# EAGLE design LipSync_Joystick_Board (EAGLE 9.5.2)
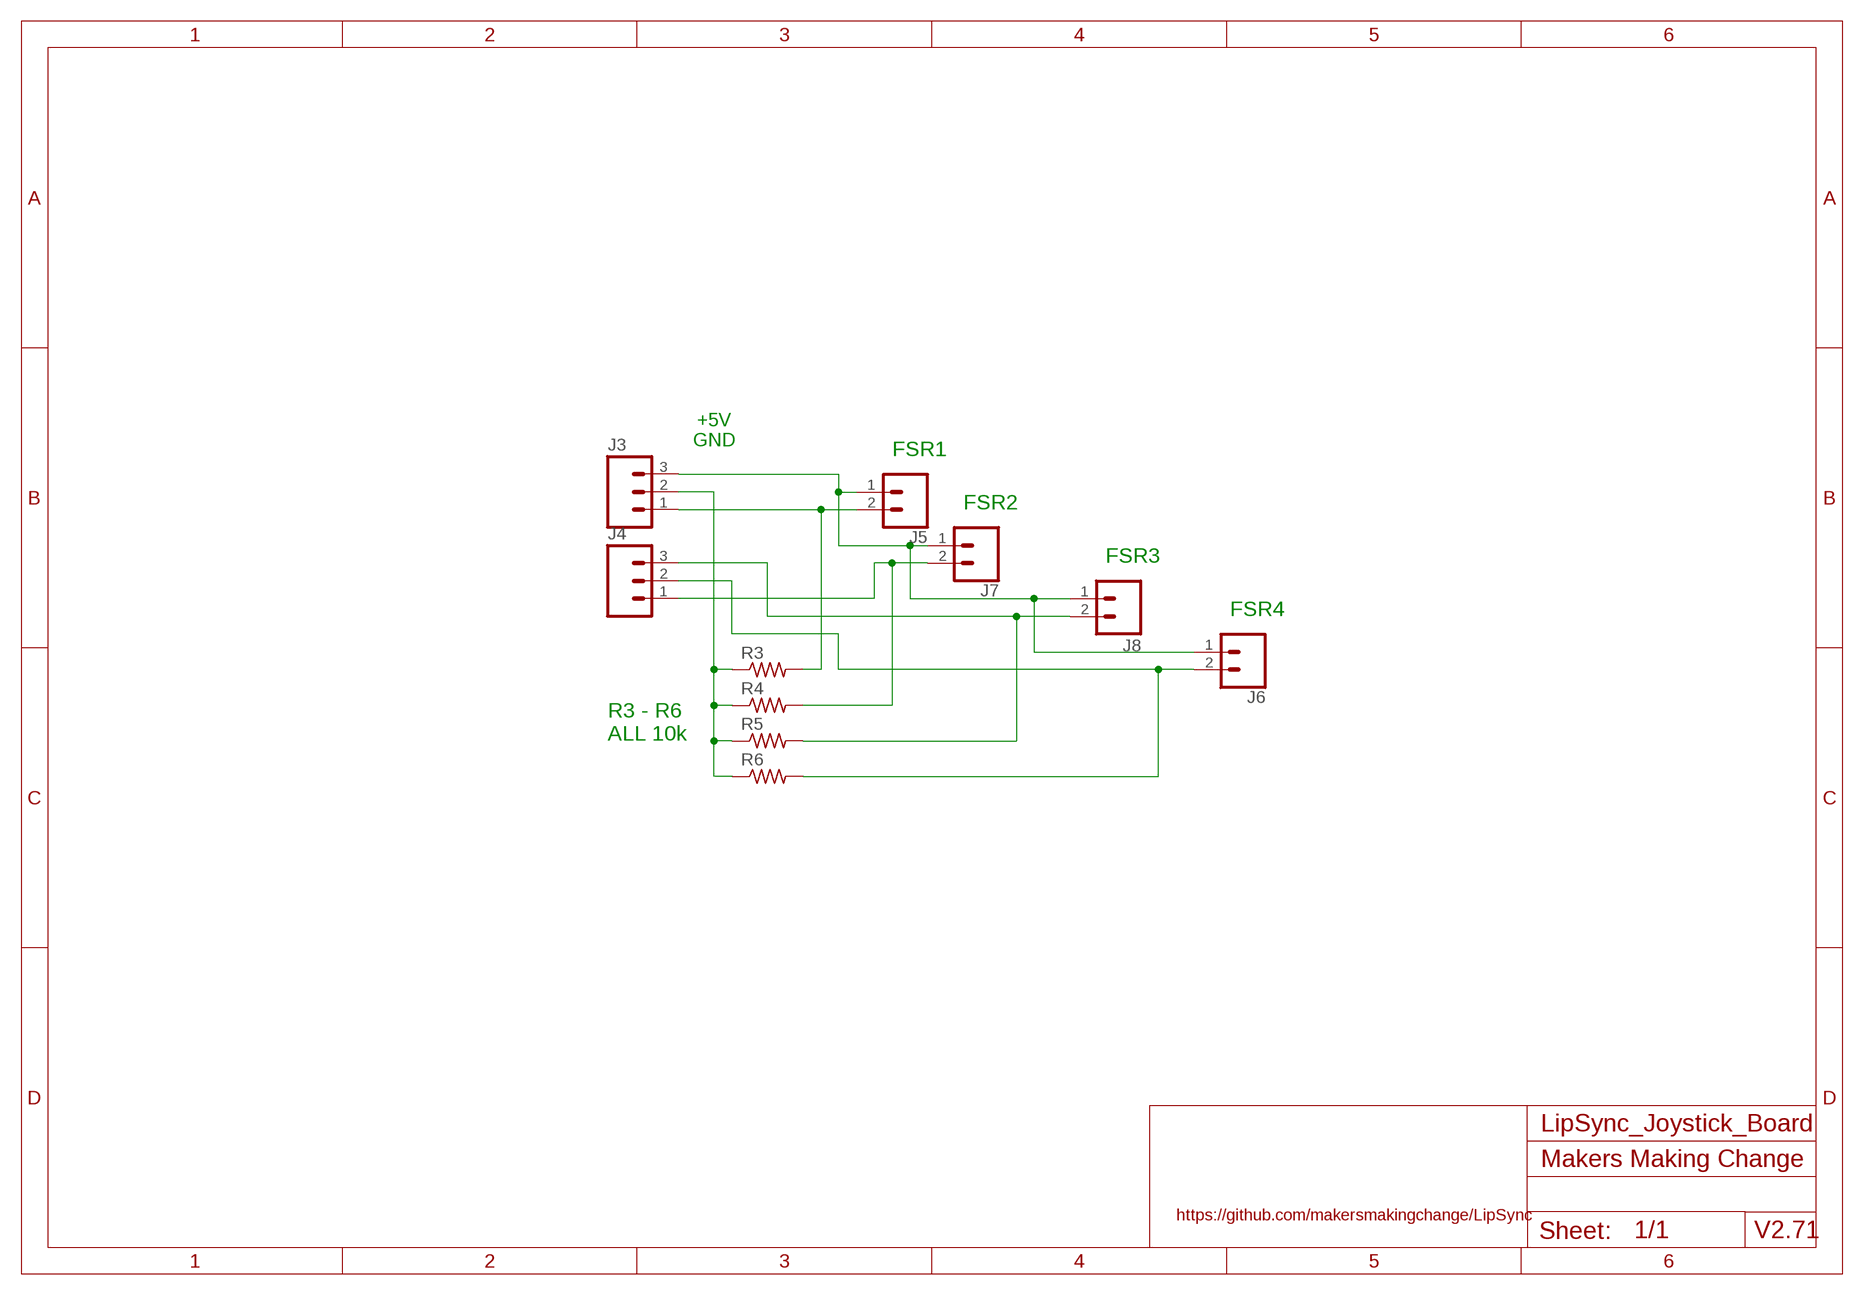
[diagram p0: schematic, sheet 1]

## Parts
J3  M03LOCK  [1X03_LOCK]
J4  M03LOCK  [1X03_LOCK]
J5  CONN_02PTH3  [1X02_LONGPADS]
J6  CONN_02PTH3  [1X02_LONGPADS]
J7  CONN_02PTH3  [1X02_LONGPADS]
J8  M02PTH3  [1X02_LONGPADS@1]
R3  R-US_0204/5  [0204/5]
R4  R-US_0204/5  [0204/5]
R5  R-US_0204/5  [0204/5]
R6  R-US_0204/5  [0204/5]

## Nets
GND3: J3.2 R3.1 R4.1 R5.1 R6.1
N$16: J3.3 J5.1 J6.1 J7.1 J8.1
N$22: J3.1 J5.2 R3.2
N$24: J4.1 J7.2 R4.2
N$27: J4.3 J8.2 R5.2
N$28 [GND3]: J4.2 J6.2 R6.2

## Notes on the sheet
- +5V
  GND
- FSR1
- FSR2
- FSR3
- FSR4
- R3 - R6
  ALL 10k
- Makers Making Change
- https://github.com/makersmakingchange/LipSync
- V2.71

## Library data of the parts
J3 J4 = SparkFun-Connectors:M03: Header 3 Standard 3-pin 0.1" header. Use with straight break away headers (SKU : PRT-00116), right angle break away headers (PRT-00553), swiss pins (PRT-00743), machine pins (PRT-00117), and female headers (PRT-00115). Molex polarized connector foot print use with SKU : PRT-08232 with associated crimp pins and housings.
J5-J7 = SparkFun-Connectors:CONN_02: Multi connection point. Often used as Generic Header-pin footprint for 0.1 inch spaced/style header connections On any of the 0.1 inch spaced packages, you can populate with these: Break Away Headers - Straight <https://www.sparkfun.com/products/116> (PRT-00116) Break Away Male Headers - Right Angle <https://www.sparkfun.com/products/553> (PRT-00553) Female Headers <https://www.sparkfun.com/products/115> (PRT-00115) Break Away Headers - Machine Pin <https://www.sparkfun.com/products/117> (PRT-00117) Break Away Female Headers - Swiss Machine Pin <https://www.sparkfun.com/products/743> (PRT-00743) For SCREWTERMINALS and SPRING TERMINALS visit here: Screw Terimnals on SparkFun.com <https://www.sparkfun.com/search/results?term=Screw+Terminals> (5mm/3.5mm/2.54mm spacing) This device is also useful as a general connection point to wire up your design to another part of your project. Our various solder wires solder well into these plated through hole pads. Hook-Up Wire - Assortment (Stranded, 22 AWG) <https://www.sparkfun.com/products/11375> (PRT-11375) Hook-Up Wire - Assortment (Solid Core, 22 AWG) <https://www.sparkfun.com/products/11367> (PRT-11367) View the entire wire category on our website here <https://www.sparkfun.com/categories/141> Special notes: Molex polarized connector foot print use with: PRT-08233 with associated crimp pins and housings. 2.54_SCREWTERM for use with PRT-10571. 3.5mm Screw Terminal footprints for PRT-08084 5mm Screw Terminal footprints for use with PRT-08432
J8 = SparkFun-Connectors:M02: Standard 2-pin 0.1" header. Use with - straight break away headers ( PRT-00116) - right angle break away headers (PRT-00553) - swiss pins (PRT-00743) - machine pins (PRT-00117) - female headers (PRT-00115) Molex polarized connector foot print use with: PRT-08233 with associated crimp pins and housings. 2.54_SCREWTERM for use with PRT-10571. 3.5mm Screw Terminal footprints for PRT-08084 5mm Screw Terminal footprints for use with PRT-08432
R3-R6 = resistor:R-US_: RESISTOR, American symbol

## Net classes
0 GND: clearance 0.205 mm
2 GND2: clearance 0.205 mm to class 0, clearance 0.205 mm to class 1, clearance 0.205 mm
3 GND3: clearance 0.205 mm to class 0, clearance 0.205 mm to class 1, clearance 0.205 mm to class 2, clearance 0.205 mm

## Board
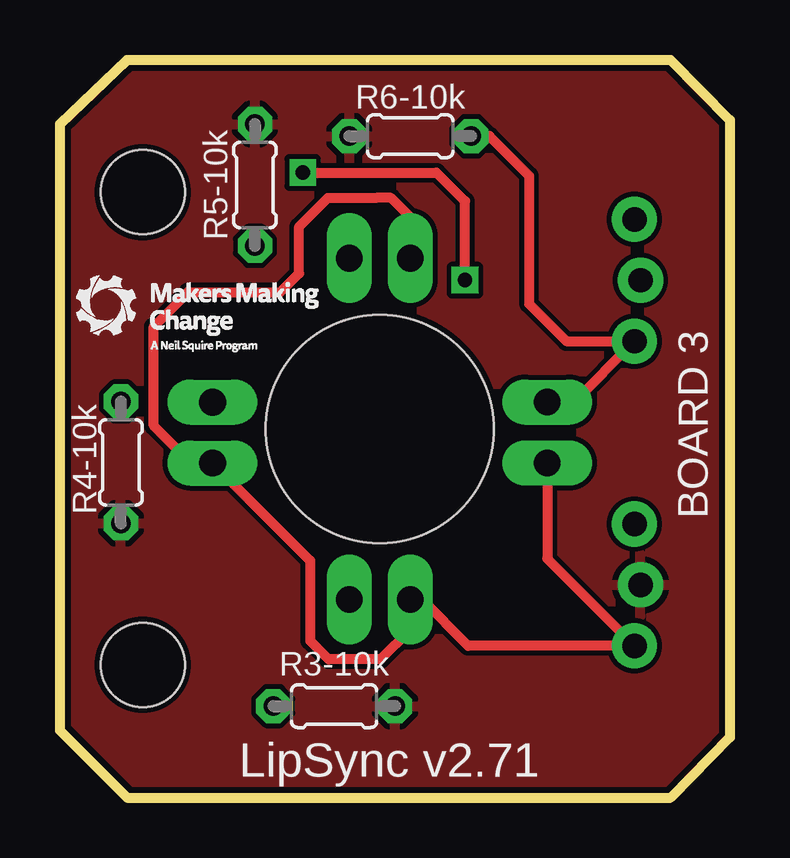
[diagram p1: board, top side]
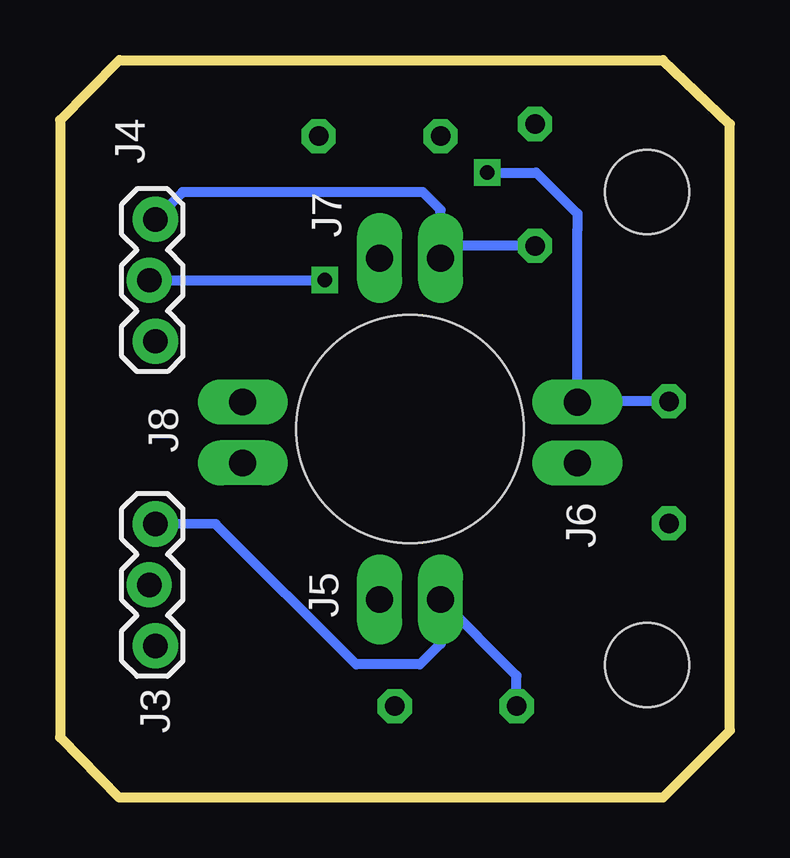
[diagram p2: board, bottom side, seen from below]

Size 27.93 x 30.73 mm. Coordinates in mm from the lower left corner, seen from the top.
Outline: 27.93,28.23 25.46,30.73 2.79,30.73 0,28.07 0,2.79 2.79,0 25.46,0 27.93,2.51 27.93,28.23
Copper layers (1*16): Top 0.035mm / dielectric 1.5mm / Bottom 0.035mm
Design rules "SparkFun": minimum track width 8mil, minimum drill 20mil, track to track 8mil, track to pad 8mil, pad to pad 8mil, via to via 8mil, smd to smd 8mil, copper to edge 10mil, drill to drill 8mil, minimum pad ring 12mil, minimum via ring 10mil, stop-mask expansion 4mil, vias tented up to drill 25mil, thermal gap 10mil
Holes 9.5 mm at 13.34,15.37
Holes 3.5 mm at 3.45,5.53 3.45,25.23

### Footprints (pad centres in the part's own frame; a part is rotated, then mirrored left to right if it is on the bottom)
1X03_LOCK = drill 1.016 pad 1.88: 1 0,0.127; 2 2.54,-0.127; 3 5.08,0.127
1X02_LONGPADS = drill 1.118 pad 1.88 long: 1 0,0; 2 2.54,0
1X02_LONGPADS@1 = drill 1.118 pad 1.88 long: 1 0,0; 2 2.54,0
0204/5 = drill 0.813 octagon: 1 -2.54,0; 2 2.54,0

### Placement (x,y rotation side)
J3  24.08,11.4 270 bottom
J4  24.08,24.09 270 bottom
J5  14.61,8.26 0 bottom
J6  6.36,13.94 90 bottom
J7  14.61,22.48 0 bottom
J8  20.31,13.94 90 bottom
R3  11.43,3.81 180 top
R4  8.13,25.53 270 top
R5  14.61,27.56 0 top
R6  2.54,13.97 90 top

### Tracks (layer width: path | path; a pad name or v marks a point on that pad's centre or on a via)
GND3
  pour Top: 25.46,0 2.79,0 0,2.79 0,28.07 2.79,30.73 25.46,30.73 27.93,28.23 27.93,2.51
N$16
  Top 0.406: J8.1 20.31,9.96 J3.3 17.02,6.32 15.08,8.26 J5.1 14.61,6.99 13.37,5.76 11.21,5.76 10.43,6.53 10.43,9.87 J6.1 5.47,13.94 3.91,15.5 3.91,19.63 5.34,21.06 9.19,21.06 9.97,21.85 9.97,23.79 11.17,24.99 13.19,24.99 13.8,24.99 14.61,24.19 J7.1
N$22
  Bottom 0.406: J3.1 21.43,11.4 15.58,5.55 12.93,5.55 12.06,6.41 J5.2 8.89,5.08 R3.2
N$24
  Bottom 0.406: R4.2 11.56,22.99 J7.2 12.06,24.49 12.8,25.23 22.82,25.23 J4.1
N$27
  Top 0.406: R5.2 17.91,27.56 19.56,25.91 19.56,20.57 21.11,19.02 J4.3 21.42,16.48 J8.2
N$28  (via drill 0.6)
  Top 0.406: v10.12,26.05 15.69,26.05 16.89,24.85 v16.89,21.56
  Bottom 0.406: R6.2 6.33,16.51 J6.2 6.36,23.66 6.35,23.67 6.35,24.33 8.07,26.05 v10.12,26.05 | J4.2 17.09,21.55 v16.89,21.56

### Text on the board
tNames: R6-10k | R5-10k | BOARD 3 | R4-10k | R3-10k | LipSync v2.71
bNames: J4 | J7 | J8 | J6 | J5 | J3